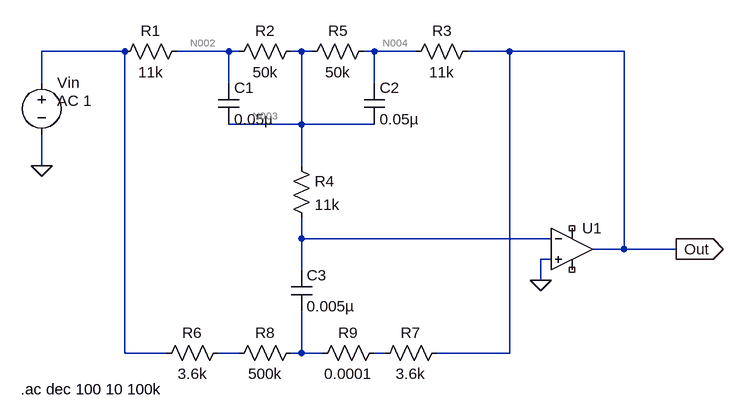
[diagram p0: schematic Equaliser.asc]
Equaliser.asc, the LTspice schematic file:
Version 4.1
SHEET 1 948 680
WIRE 0 -368 -128 -368
WIRE 160 -368 80 -368
WIRE 176 -368 160 -368
WIRE 272 -368 256 -368
WIRE 288 -368 272 -368
WIRE 384 -368 368 -368
WIRE 448 -368 384 -368
WIRE 592 -368 528 -368
WIRE 768 -368 592 -368
WIRE -128 -320 -128 -368
WIRE 160 -320 160 -368
WIRE 384 -320 384 -368
WIRE 272 -256 272 -368
WIRE 272 -256 160 -256
WIRE 384 -256 272 -256
WIRE -128 -192 -128 -240
WIRE 272 -192 272 -256
WIRE 272 -80 272 -112
WIRE 656 -80 272 -80
WIRE 768 -64 768 -368
WIRE 768 -64 720 -64
WIRE 848 -64 768 -64
WIRE 656 -48 640 -48
WIRE 272 -32 272 -80
WIRE 640 -16 640 -48
WIRE 0 96 0 -368
WIRE 64 96 0 96
WIRE 176 96 144 96
WIRE 272 96 272 32
WIRE 272 96 256 96
WIRE 304 96 272 96
WIRE 400 96 384 96
WIRE 592 96 592 -368
WIRE 592 96 480 96
FLAG 640 -16 0
FLAG 848 -64 Out
IOPIN 848 -64 Out
FLAG -128 -192 0
SYMBOL res 96 -384 R90
WINDOW 0 0 56 VBottom 2
WINDOW 3 32 56 VTop 2
SYMATTR InstName R1
SYMATTR Value 11k
SYMBOL res 544 -384 R90
WINDOW 0 0 56 VBottom 2
WINDOW 3 32 56 VTop 2
SYMATTR InstName R3
SYMATTR Value 11k
SYMBOL cap 144 -320 R0
SYMATTR InstName C1
SYMATTR Value 0.05µ
SYMBOL cap 368 -320 R0
SYMATTR InstName C2
SYMATTR Value 0.05µ
SYMBOL res 256 -208 R0
SYMATTR InstName R4
SYMATTR Value 11k
SYMBOL cap 256 -32 R0
SYMATTR InstName C3
SYMATTR Value 0.005µ
SYMBOL OpAmps\\UniversalOpAmp2 688 -64 R0
SYMATTR InstName U1
SYMBOL res 272 -384 R90
WINDOW 0 0 56 VBottom 2
WINDOW 3 32 56 VTop 2
SYMATTR InstName R2
SYMATTR Value 50k
SYMBOL res 384 -384 R90
WINDOW 0 0 56 VBottom 2
WINDOW 3 32 56 VTop 2
SYMATTR InstName R5
SYMATTR Value 50k
SYMBOL res 160 80 R90
WINDOW 0 0 56 VBottom 2
WINDOW 3 32 56 VTop 2
SYMATTR InstName R6
SYMATTR Value 3.6k
SYMBOL res 496 80 R90
WINDOW 0 0 56 VBottom 2
WINDOW 3 32 56 VTop 2
SYMATTR InstName R7
SYMATTR Value 3.6k
SYMBOL res 272 80 R90
WINDOW 0 0 56 VBottom 2
WINDOW 3 32 56 VTop 2
SYMATTR InstName R8
SYMATTR Value 500k
SYMBOL res 400 80 R90
WINDOW 0 0 56 VBottom 2
WINDOW 3 32 56 VTop 2
SYMATTR InstName R9
SYMATTR Value 0.0001
SYMBOL voltage -128 -336 R0
WINDOW 123 24 44 Left 2
WINDOW 39 0 0 Left 0
SYMATTR Value2 AC 1
SYMATTR InstName Vin
SYMATTR Value ""
TEXT -160 152 Left 2 !.ac dec 100 10 100k

The netlist it stands for:
* Equaliser.asc
R1 N002 N001 11k
R3 Out N004 11k
C1 N002 N003 0.05µ
C2 N004 N003 0.05µ
R4 N003 N005 11k
C3 N005 N007 0.005µ
X§U1 0 N005 NC_01 NC_02 Out level2 Avol=1Meg GBW=10Meg Slew=10Meg Ilimit=25m Rail=0 Vos=0 En=0 Enk=0 In=0 Ink=0 Rin=500Meg  ; pins In+ In- V+ V- OUT
R2 N003 N002 50k
R5 N004 N003 50k
R6 N006 N001 3.6k
R7 Out N008 3.6k
R8 N007 N006 500k
R9 N008 N007 0.0001
Vin N001 0 AC 1
.ac dec 100 10 100k
.lib UniversalOpAmp2.lib
.backanno
.end

* Results of the author's LTspice run, read from the files saved beside the schematic
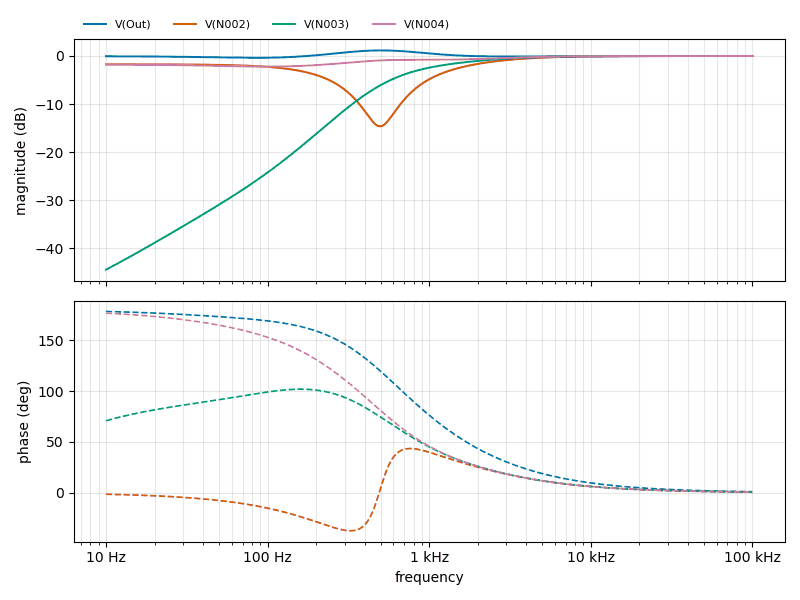
[diagram p1: AC Analysis of Equaliser.asc, plotted from the saved traces]
* AC Analysis, 1 run:
*   V(Out): -0.06 dB at 10 Hz, -0.00 dB at 100 kHz, peak 1.16 dB at 501.2 Hz
*   V(N002): -1.73 dB at 10 Hz, -0.00 dB at 100 kHz, peak -0.00 dB at 100 kHz, 3 dB below the peak at 1.348 kHz
*   V(N003): -44.50 dB at 10 Hz, -0.00 dB at 100 kHz, peak -0.00 dB at 100 kHz, 3 dB below the peak at 844.7 Hz
*   V(N004): -1.79 dB at 10 Hz, -0.00 dB at 100 kHz, peak -0.00 dB at 100 kHz